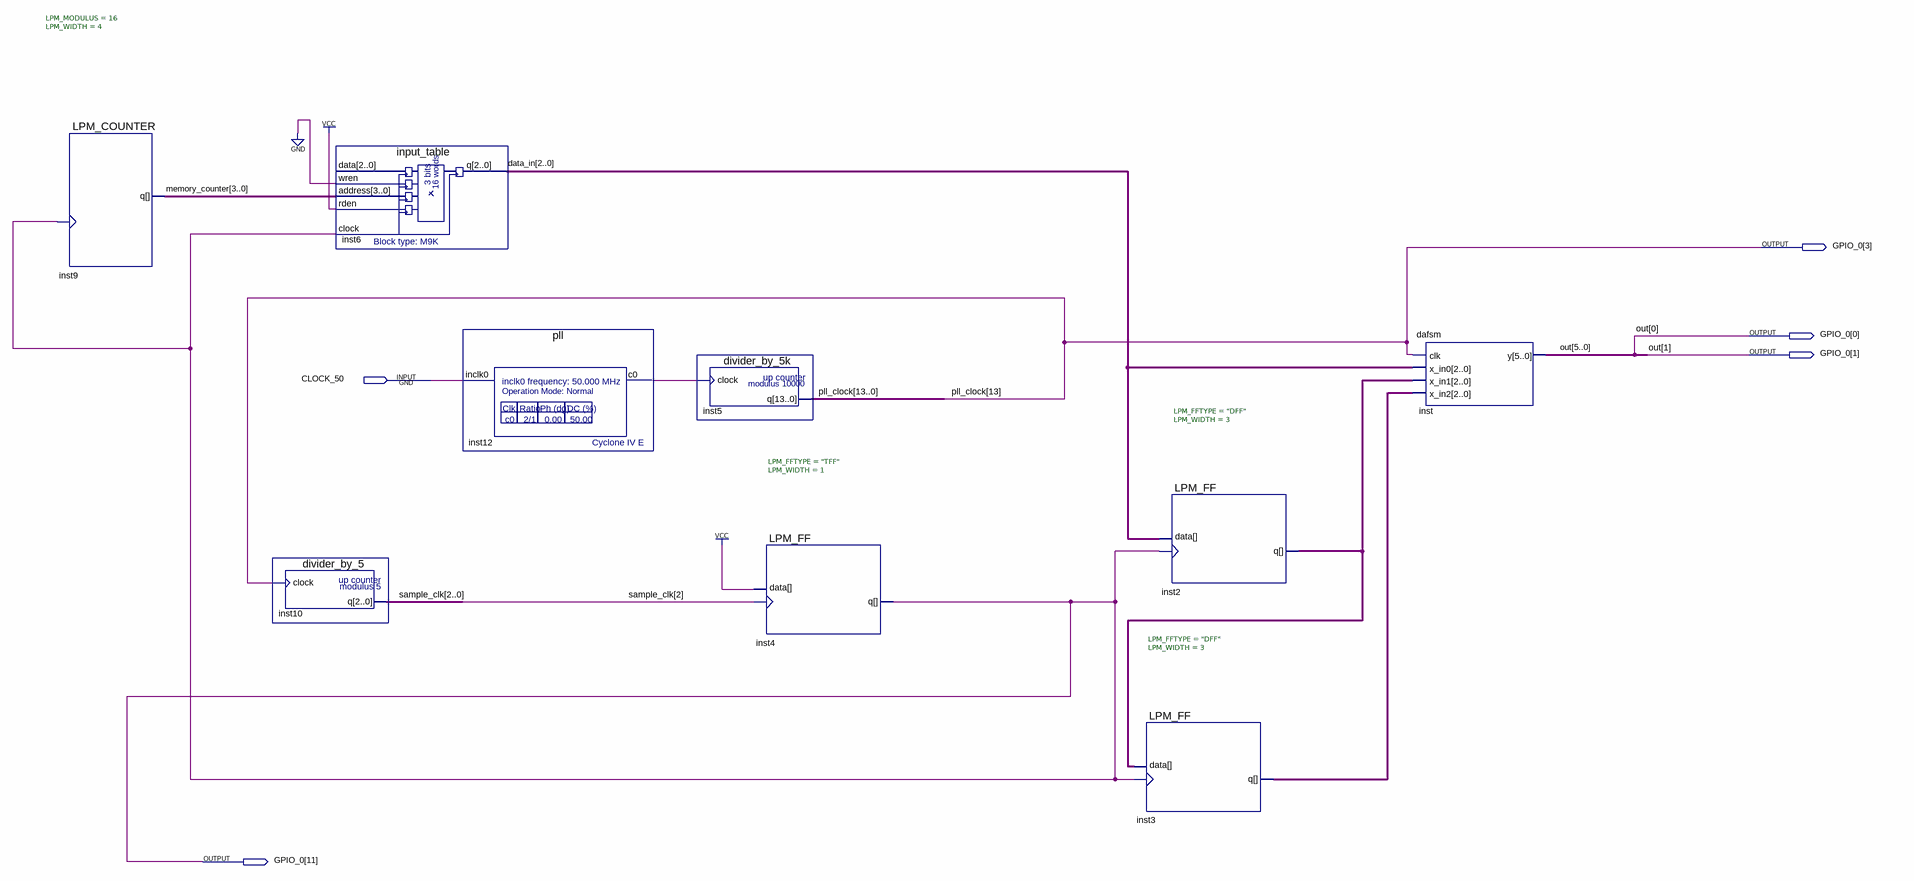
[diagram p0: schematic sheet]
// Quartus schematic FIR.bdf as structural Verilog: 9 symbols, 5 pins
module FIR (
  input  CLOCK_50,
  output [11:0] GPIO_0
);

  wire inst12_c0;
  wire [2:0] data_in, inst2_q, inst3_q, sample_clk;
  wire [3:0] memory_counter;
  wire [5:2] out;
  wire [12:0] pll_clock;

  LPM_COUNTER #(.LPM_MODULUS(16), .LPM_WIDTH(4)) inst9 (.clock(GPIO_0[11]), .q(memory_counter));
  divider_by_5 inst10 (.clock(GPIO_0[3]), .q(sample_clk));
  input_table inst6 (
    .wren(1'b0), .address(memory_counter), .rden(1'b1), .clock(GPIO_0[11]), .q(data_in));  // open: data
  pll inst12 (.inclk0(CLOCK_50), .c0(inst12_c0));
  divider_by_5k inst5 (.clock(inst12_c0), .q({GPIO_0[3], pll_clock}));
  LPM_FF #(.LPM_FFTYPE("TFF"), .LPM_WIDTH(1)) inst4 (.clock(sample_clk[2]), .data(1'b1), .q(GPIO_0[11]));
  LPM_FF #(.LPM_FFTYPE("DFF"), .LPM_WIDTH(3)) inst3 (.clock(GPIO_0[11]), .data(inst2_q), .q(inst3_q));
  LPM_FF #(.LPM_FFTYPE("DFF"), .LPM_WIDTH(3)) inst2 (.clock(GPIO_0[11]), .data(data_in), .q(inst2_q));
  dafsm inst (.clk(GPIO_0[3]), .x_in0(data_in), .x_in1(inst2_q), .x_in2(inst3_q), .y({out, GPIO_0[1:0]}));

  // Other names for the same wires on the sheet: out[1:0] = GPIO_0[1:0]; pll_clock[13] = GPIO_0[3]
endmodule
